# EAGLE design control_board (EAGLE 7.6.0)
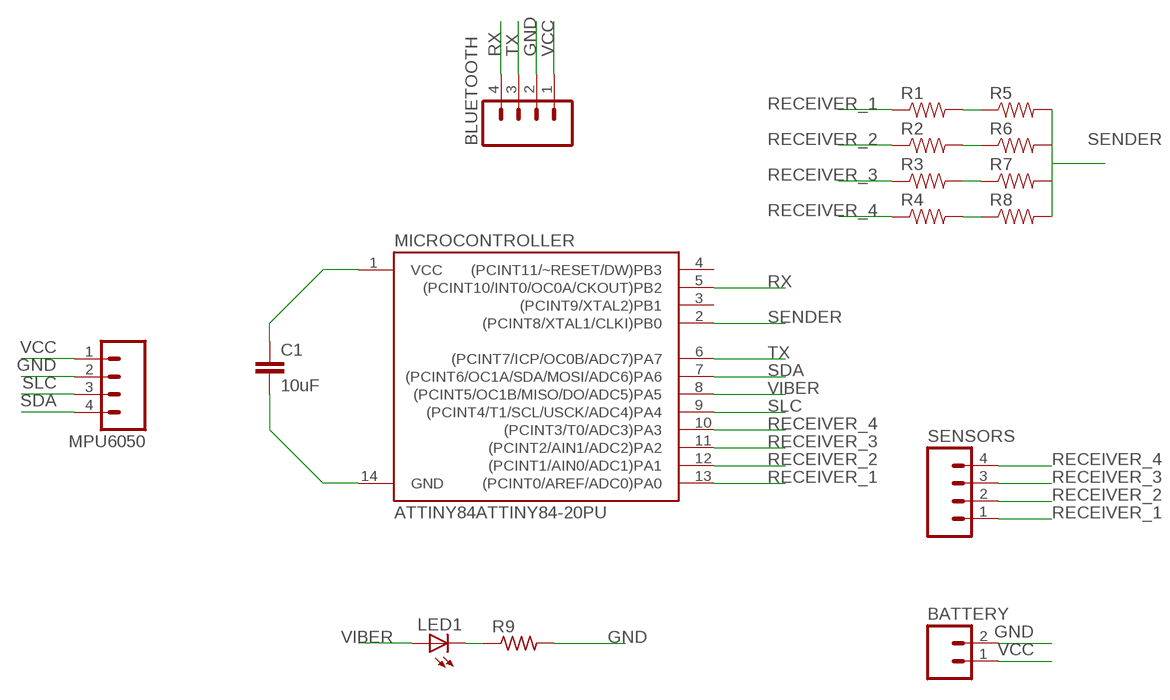
[diagram p0: schematic, sheet 1]

## Parts
BATTERY  M02POLAR_LOCK  [MOLEX-1X2_LOCK]
BLUETOOTH  M04PTH  [1X04]
C1  10uF  CAPPTH2  [CAP-PTH-SMALL2]
LED1  LED5MM  [LED5MM]
MICROCONTROLLER  ATTINY84ATTINY84-20PU  [DIL14]
MPU6050  M04PTH  [1X04]
R1  RESISTOREZ  [AXIAL-0.3EZ]
R2  RESISTOREZ  [AXIAL-0.3EZ]
R3  RESISTOREZ  [AXIAL-0.3EZ]
R4  RESISTOREZ  [AXIAL-0.3EZ]
R5  RESISTOREZ  [AXIAL-0.3EZ]
R6  RESISTOREZ  [AXIAL-0.3EZ]
R7  RESISTOREZ  [AXIAL-0.3EZ]
R8  RESISTOREZ  [AXIAL-0.3EZ]
R9  R-US_0207/10  [0207/10]
SENSORS  M04PTH  [1X04]

## Nets
GND: BATTERY.2 BLUETOOTH.2 C1.2 MICROCONTROLLER.14(GND) MPU6050.2 R9.2
N$1: R2.P$2 R6.P$1
N$2: R3.P$2 R7.P$1
N$6: R1.P$2 R5.P$1
N$9: R4.P$2 R8.P$1
N$25: LED1.K(C) R9.1
RECEIVER_1: MICROCONTROLLER.13((PCINT0/AREF/ADC0)PA0) R1.P$1 SENSORS.1
RECEIVER_2: MICROCONTROLLER.12((PCINT1/AIN0/ADC1)PA1) R2.P$1 SENSORS.2
RECEIVER_3: MICROCONTROLLER.11((PCINT2/AIN1/ADC2)PA2) R3.P$1 SENSORS.3
RECEIVER_4: MICROCONTROLLER.10((PCINT3/T0/ADC3)PA3) R4.P$1 SENSORS.4
RX: BLUETOOTH.4 MICROCONTROLLER.5((PCINT10/INT0/OC0A/CKOUT)PB2)
SDA: MICROCONTROLLER.7((PCINT6/OC1A/SDA/MOSI/ADC6)PA6) MPU6050.4
SENDER: MICROCONTROLLER.2((PCINT8/XTAL1/CLKI)PB0) R5.P$2 R6.P$2 R7.P$2 R8.P$2
SLC: MICROCONTROLLER.9((PCINT4/T1/SCL/USCK/ADC4)PA4) MPU6050.3
TX: BLUETOOTH.3 MICROCONTROLLER.6((PCINT7/ICP/OC0B/ADC7)PA7)
VCC: BATTERY.1 BLUETOOTH.1 C1.1 MICROCONTROLLER.1(VCC) MPU6050.1
VIBER: LED1.A MICROCONTROLLER.8((PCINT5/OC1B/MISO/DO/ADC5)PA5)
Unconnected: MICROCONTROLLER.3((PCINT9/XTAL2)PB1) MICROCONTROLLER.4((PCINT11/~RESET/DW)PB3)

## Library data of the parts
BATTERY = SparkFun-Connectors:M02: Standard 2-pin 0.1" header. Use with - straight break away headers ( PRT-00116) - right angle break away headers (PRT-00553) - swiss pins (PRT-00743) - machine pins (PRT-00117) - female headers (PRT-00115) Molex polarized connector foot print use with: PRT-08233 with associated crimp pins and housings. 2.54_SCREWTERM for use with PRT-10571. 3.5mm Screw Terminal footprints for PRT-08084 5mm Screw Terminal footprints for use with PRT-08432
BLUETOOTH MPU6050 SENSORS = SparkFun-Connectors:M04: Header 4 Standard 4-pin 0.1" header. Use with straight break away headers (SKU : PRT-00116), right angle break away headers (PRT-00553), swiss pins (PRT-00743), machine pins (PRT-00117), and female headers (PRT-00115). Molex polarized connector foot print use with SKU : PRT-08231 with associated crimp pins and housings. 1MM SMD Version SKU: PRT-10208; PROD_ID: CONN-09696
C1 = SparkFun-Capacitors:CAP: Capacitor Standard 0603 ceramic capacitor, and 0.1" leaded capacitor.
LED1 = adafruit:LED: LED OSRAM: - CHIPLED LG R971, LG N971, LY N971, LG Q971, LY Q971, LO R971, LY R971 LH N974, LH R974 LS Q976, LO Q976, LY Q976 LO Q996 - Hyper CHIPLED LW Q18S LB Q993, LB Q99A, LB R99A - SideLED LS A670, LO A670, LY A670, LG A670, LP A670 LB A673, LV A673, LT A673, LW A673 LH A674 LY A675 LS A676, LA A676, LO A676, LY A676, LW A676 LS A679, LY A679, LG A679 - Hyper Micro SIDELED® LS Y876, LA Y876, LO Y876, LY Y876 LT Y87S - SmartLED LW L88C, LW L88S LB L89C, LB L89S, LG L890 LS L89K, LO L89K, LY L89K LS L896, LA L896, LO L896, LY L896 - TOPLED LS T670, LO T670, LY T670, LG T670, LP T670 LSG T670, LSP T670, LSY T670, LOP T670, LYG T670 LG T671, LOG T671, LSG T671 LB T673, LV T673, LT T673, LW T673 LH T674 LS T676, LA T676, LO T676, LY T676, LB T676, LH T676, LSB T676, LW T676 LB T67C, LV T67C, LT T67C, LS T67K, LO T67K, LY T67K, LW E67C LS E67B, LA E67B, LO E67B, LY E67B, LB E67C, LV E67C, LT E67C LW T67C LS T679, LY T679, LG T679 LS T770, LO T770, LY T770, LG T770, LP T770 LB T773, LV T773, LT T773, LW T773 LH T774 LS E675, LA E675, LY E675, LS T675 LS T776, LA T776, LO T776, LY T776, LB T776 LHGB T686 LT T68C, LB T68C - Hyper Mini TOPLED® LB M676 - Mini TOPLED Santana® LG M470 LS M47K, LO M47K, LY M47K Source: http://www.osram.convergy.de/
MICROCONTROLLER = SparkFun-DigitalIC:ATTINY84: Atmel 14-pin 2/4/8kB flash uC
R1-R8 = SparkFun-Passives:RESISTOR: Resistor Basic schematic elements and footprints for 0603, 1206, and PTH resistors.
R9 = adafruit:R-US_: RESISTOR, American symbol

## Board
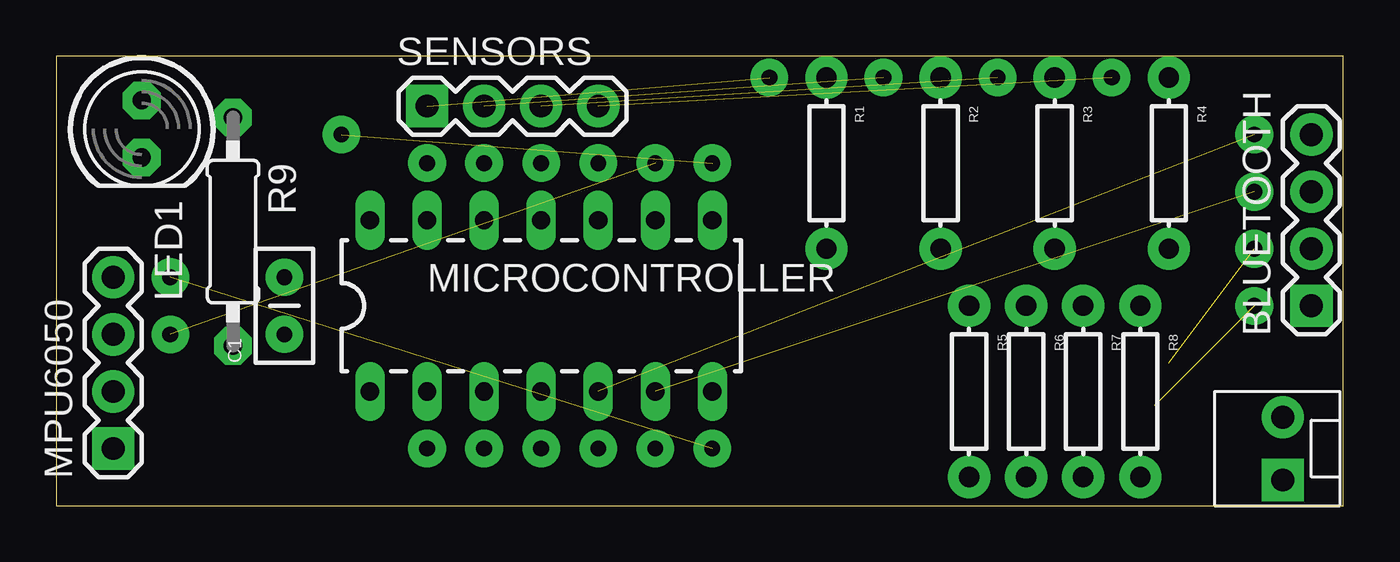
[diagram p1: board, top side]
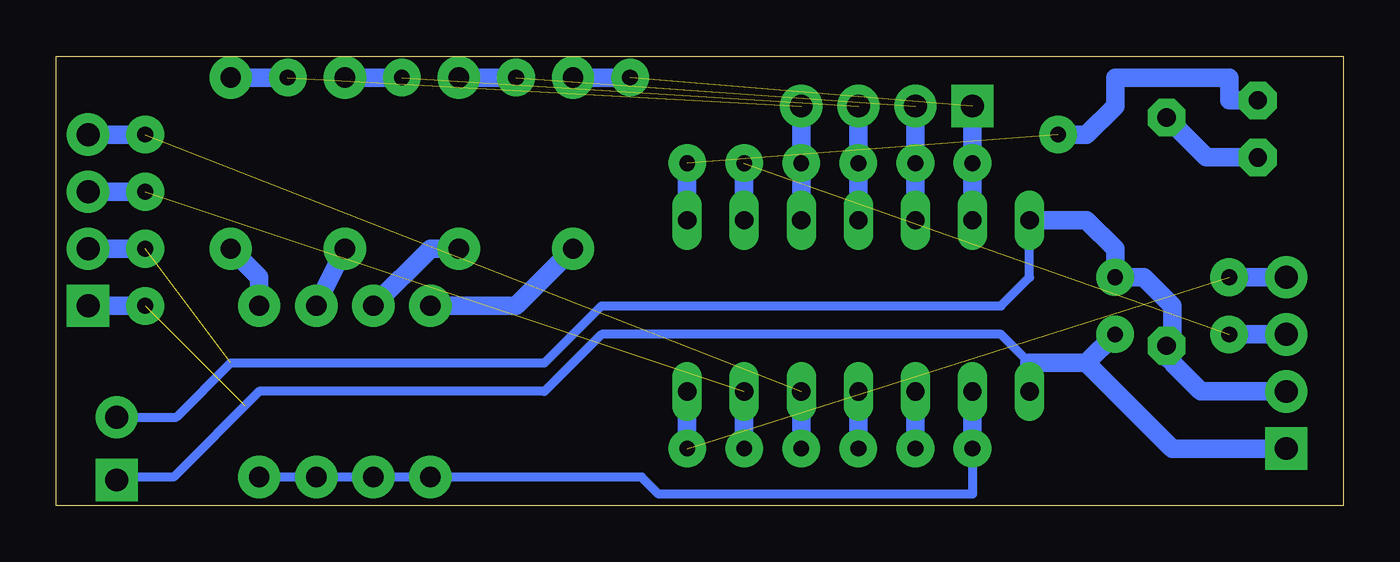
[diagram p2: board, bottom side, seen from below]

Size 57.3 x 20 mm. Coordinates in mm from the lower left corner, seen from the top.
Outline: 0,0 57.3,0 57.3,20 0,20 0,0
Copper layers (1*16): Top 0.035mm / dielectric 1.5mm / Bottom 0.035mm
Design rules "default": minimum track width 10mil, minimum drill 24mil, track to track 8mil, track to pad 8mil, pad to pad 8mil, via to via 8mil, smd to smd 8mil, copper to edge 40mil, drill to drill 8mil, minimum pad ring 10mil, minimum via ring 8mil, stop-mask expansion 4mil, vias tented up to drill 0mil, thermal gap 10mil

### Footprints (pad centres in the part's own frame; a part is rotated, then mirrored left to right if it is on the bottom)
MOLEX-1X2_LOCK = drill 1.016 pad 1.88 square: 1 -0.127,0 | drill 1.016 pad 1.88: 2 2.667,0
1X04 = drill 1.016 pad 1.88 square: 1 0,0 | drill 1.016 pad 1.88: 2 2.54,0; 3 5.08,0; 4 7.62,0
CAP-PTH-SMALL2 = drill 0.7 pad 1.651: 1 0,0; 2 2.54,0
LED5MM = drill 0.813 pad 1.676 octagon: A -1.27,0; K 1.27,0
DIL14 = drill 0.813 long: 1 -8.89,-3.81; 2 -6.35,-3.81; 3 -3.81,-3.81; 4 -1.27,-3.81; 5 1.27,-3.81; 6 3.81,-3.81; 7 6.35,-3.81; 8 6.35,3.81; 9 3.81,3.81; 10 1.27,3.81; 11 -1.27,3.81; 12 -3.81,3.81; 13 -6.35,3.81; 14 -8.89,3.81
AXIAL-0.3EZ = drill 0.9 pad 1.88: P$1 -3.81,0; P$2 3.81,0
0207/10 = drill 0.813 pad 1.676 octagon: 1 -5.08,0; 2 5.08,0

### Placement (x,y rotation side)
BATTERY  54.61,1.27 90 top
BLUETOOTH  55.88,8.89 90 top
C1  10.16,7.62 90 top
LED1  3.81,16.76 270 top
MICROCONTROLLER  22.86,8.89 0 top
MPU6050  2.54,2.54 90 top
R1  34.29,15.24 270 top
R2  39.37,15.24 270 top
R3  44.45,15.24 270 top
R4  49.53,15.24 270 top
R5  40.64,5.08 270 top
R6  43.18,5.08 270 top
R7  45.72,5.08 270 top
R8  48.26,5.08 270 top
R9  7.87,12.19 270 top
SENSORS  16.51,17.78 0 top

### Tracks (layer width: path | path; a pad name or v marks a point on that pad's centre or on a via)
GND  (1 unrouted)
  Bottom 0.406: BATTERY.2 51.94,3.94 49.53,6.35 35.56,6.35 33.02,8.89 15.24,8.89 13.97,10.16 MICROCONTROLLER.14
  Bottom 0.813: MICROCONTROLLER.14 11.43,12.7 10.16,11.43 C1.2 8.89,10.16 7.62,8.89 7.62,6.35 | MPU6050.2 6.35,5.08 7.62,6.35 | BLUETOOTH.2 53.34,11.43 | R9.2 7.87,6.6 7.62,6.35
N$1
  Bottom 0.813: R2.P$2 40.64,11.43 R6.P$1
N$2
  Bottom 0.813: R3.P$2 R7.P$1
N$3  (via drill 0.7 pad 1.68)
  other vias: 31.75,19.05
N$4  (via drill 0.7 pad 1.68)
  other vias: 16.51,2.54
N$5  (via drill 0.7 pad 1.68)
  Bottom 0.813: v19.05,2.54 19.05,5.08
N$6
  Bottom 0.813: R1.P$2 36.83,8.89 R5.P$1
N$7  (via drill 0.7 pad 1.68)
  other vias: 36.83,19.05
N$8  (via drill 0.7 pad 1.68)
  other vias: 41.91,19.05
N$9
  Bottom 0.813: R8.P$1 48.26,10.16 R4.P$2
N$10  (via drill 0.7 pad 1.68)
  other vias: 46.99,19.05
N$11  (via drill 0.7 pad 1.68)
  other vias: 53.34,8.89
N$12  (via drill 0.7 pad 1.68)
  other vias: 16.51,15.24
N$13  (via drill 0.7 pad 1.68)
  other vias: 19.05,15.24
N$14  (via drill 0.7 pad 1.68)
  other vias: 21.59,15.24
N$15  (via drill 0.7 pad 1.68)
  other vias: 24.13,15.24
N$16  (via drill 0.7 pad 1.68)
  Bottom 0.813: v21.59,2.54 21.59,5.08
N$17  (via drill 0.7 pad 1.68)
  other vias: 24.13,2.54
N$18  (via drill 0.7 pad 1.68)
  other vias: 26.67,2.54
N$19  (via drill 0.7 pad 1.68)
  other vias: 29.21,2.54
N$20  (via drill 0.7 pad 1.68)
  other vias: 26.67,15.24
N$21  (via drill 0.7 pad 1.68)
  other vias: 53.34,11.43
N$22  (via drill 0.7 pad 1.68)
  other vias: 53.34,13.97
N$23  (via drill 0.7 pad 1.68)
  other vias: 53.34,16.51
N$24  (via drill 0.7 pad 1.68)
  other vias: 29.21,15.24
N$25
  Bottom 0.813: LED1.K 6.1,15.49 R9.1
RECEIVER_1  (1 unrouted)
  Bottom 0.813: R1.P$1 31.75,19.05 | SENSORS.1 MICROCONTROLLER.13
RECEIVER_2  (1 unrouted)
  Bottom 0.813: R2.P$1 36.83,19.05 | SENSORS.2 MICROCONTROLLER.12
RECEIVER_3  (1 unrouted)
  Bottom 0.813: R3.P$1 41.91,19.05 | SENSORS.3 MICROCONTROLLER.11
RECEIVER_4  (1 unrouted)
  Bottom 0.813: R4.P$1 46.99,19.05 | SENSORS.4 MICROCONTROLLER.10
RX  (1 unrouted)
  Bottom 0.813: MICROCONTROLLER.5 24.13,2.54 | BLUETOOTH.4 53.34,16.51
SDA  (via drill 0.7 pad 1.68)  (1 unrouted)
  Bottom 0.813: MPU6050.4 v5.08,10.16 | MICROCONTROLLER.7 29.21,2.54
SENDER
  Bottom 0.406: 16.51,2.54 16.51,0.51 30.48,0.51 31.24,1.27 R5.P$2 R6.P$2 R7.P$2 R8.P$2
  Bottom 0.813: MICROCONTROLLER.2 16.51,2.54
SLC  (via drill 0.7 pad 1.68)  (1 unrouted)
  Bottom 0.813: MPU6050.3 v5.08,7.62 | MICROCONTROLLER.9 26.67,15.24
TX  (1 unrouted)
  Bottom 0.813: MICROCONTROLLER.6 26.67,2.54 | BLUETOOTH.3 53.34,13.97
VCC  (1 unrouted)
  Bottom 0.406: 13.97,6.35 15.24,7.62 33.02,7.62 35.56,5.08 48.26,5.08 52.07,1.27 54.48,1.27 BATTERY.1
  Bottom 0.813: MICROCONTROLLER.1 13.97,6.35 11.43,6.35 | 11.43,6.35 C1.1 | MPU6050.1 7.62,2.54 11.43,6.35 | BLUETOOTH.1 53.34,8.89
VIBER  (via drill 0.7 pad 1.68)  (1 unrouted)
  Bottom 0.813: MICROCONTROLLER.8 29.21,15.24 | LED1.A 5.08,18.03 5.08,19.05 10.16,19.05 10.16,17.78 11.43,16.51 v12.7,16.51